# Altium schematic sheet zasilanie.SchDoc: Power supply
size A4
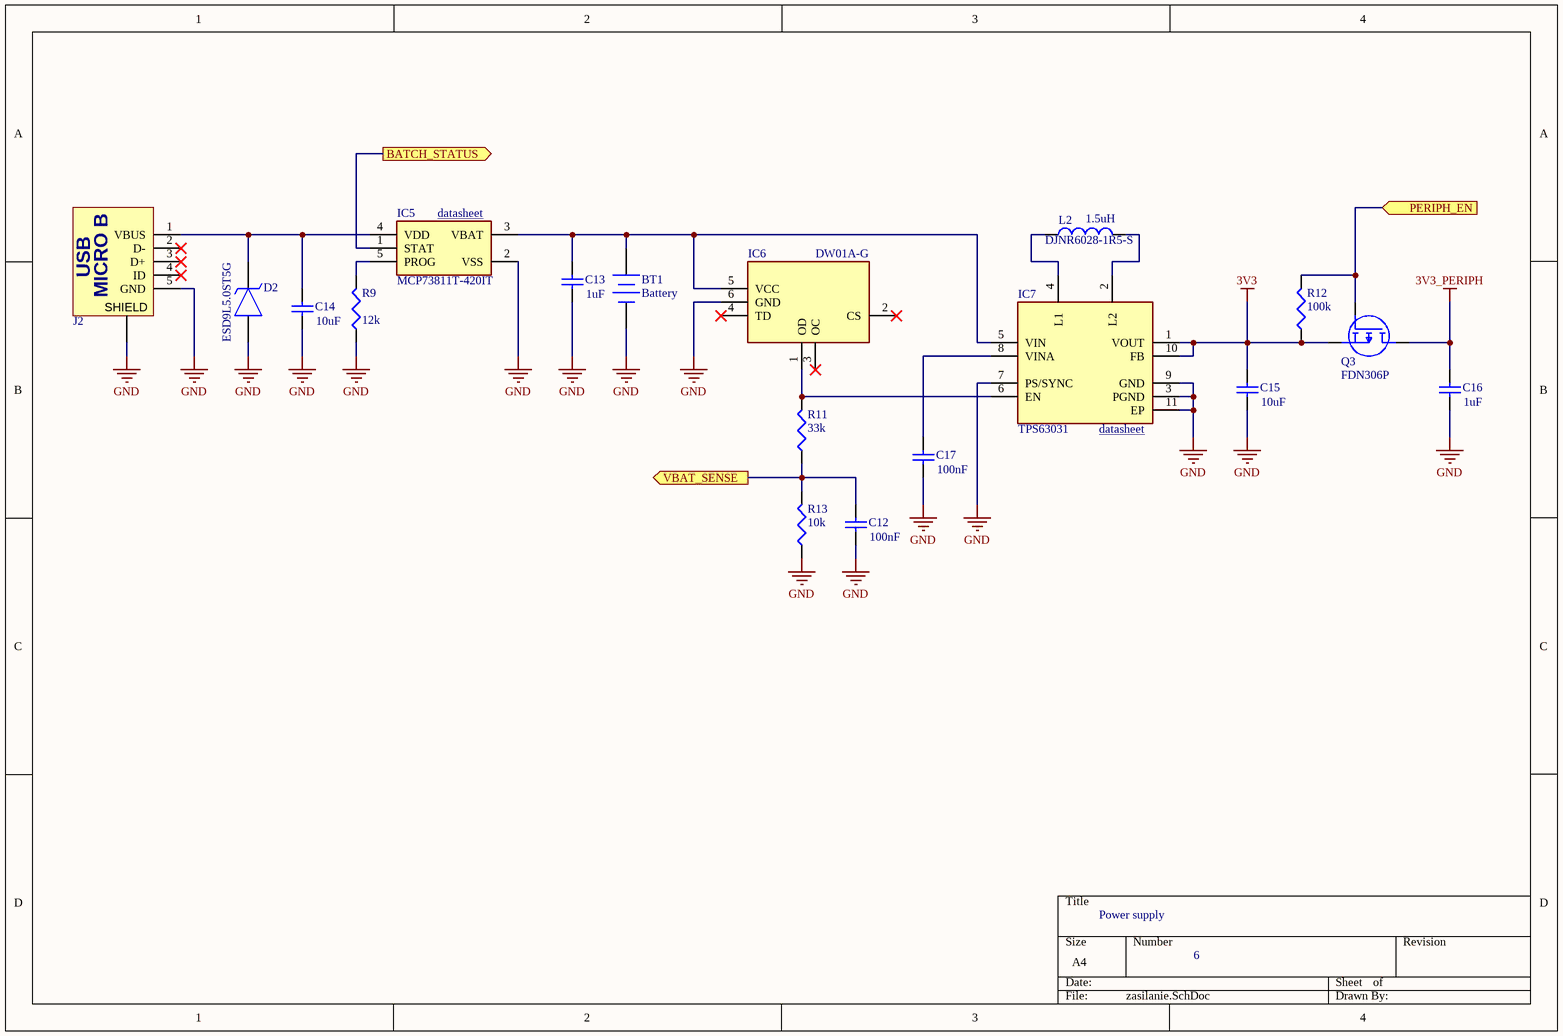
[diagram p0: zasilanie.SchDoc]

## Parts
BT1  Battery  [BAT_PAD]
C12  value 100nF  [C0805]  (hidden comment: Cap)
C13  value 1uF  [cap-0603]  (hidden comment: Cap)
C14  value 10uF  [cap-0603]  (hidden comment: Cap)
C15  value 10uF  [cap-0603]  (hidden comment: Cap)
C16  value 1uF  [cap-0603]  (hidden comment: Cap)
C17  value 100nF  [C0805]  (hidden comment: Cap)
D2  ESD9L5.0ST5G  [SODFL1006X40N]
IC5  MCP73811T-420IT  [SOT95P270X145-5N]
IC6  DW01A-G  [SOT95P280X135-6N]
IC7  TPS63031  [SON50P250X250X80-11N-D]
J2  Micro USB  [101181930001LF]  (value not drawn)
L2  DJNR6028-1R5-S  value 1.5uH  [DJNR6028-1R5-S]
Q3  FDN306P  [SOT95P237X112-3N]
R9  value 12k  [R0603]  (hidden comment: Res3)
R11  value 33k  [R0603]  (hidden comment: Res3)
R12  value 100k  [R0603]  (hidden comment: Res3)
R13  value 10k  [R0603]  (hidden comment: Res3)

## Ports
BATCH_STATUS (out), PERIPH_EN (in), VBAT_SENSE (out)

## Nets
3V3: C15.2 IC7.1(VOUT) IC7.10(FB) Q3.2(S) R12.2
3V3_PERIPH: C16.2 Q3.3(D)
GND: BT1.2(-) C12.1 C13.1 C14.1 C15.1 C16.1 C17.1 D2.2(A) IC5.2(VSS) IC6.6(GND) IC7.3(PGND) IC7.7(PS/SYNC) IC7.9(GND) IC7.11(EP) J2.5(GND) J2.6(SHIELD) R9.1 R13.2
BATCH_STATUS: IC5.1(STAT) ; port BATCH_STATUS
PERIPH_EN: Q3.1(G) R12.1 ; port PERIPH_EN
VBAT_SENSE: C12.2 R11.2 R13.1 ; port VBAT_SENSE
NetBT1_1: BT1.1(+) C13.2 IC5.3(VBAT) IC6.5(VCC) IC7.5(VIN)
NetC14_2: C14.2 D2.1(K) IC5.4(VDD) J2.1(VBUS)
NetC17_2: C17.2 IC7.8(VINA)
NetIC5_5: IC5.5(PROG) R9.2
NetIC6_1: IC6.1(OD) IC7.6(EN) R11.1
NetIC7_2: IC7.2(L2) L2.2
NetIC7_4: IC7.4(L1) L2.1

Not connected (* = marked no-connect by the designer): IC6 2(CS)* 3(OC)* 4(TD)*; J2 2(D-)* 3(D+)* 4(ID)*

## Notes on the sheet
- (near IC5) datasheet <http://ww1.microchip.com/downloads/en/DeviceDoc/MCP73831-Family-Data-Sheet-DS20001984H.pdf>
- (near IC7) datasheet <https://www.ti.com/lit/ds/slvs696d/slvs696d.pdf?ts=1594227141854&ref_url=https%253A%252F%252Fwww.google.com%252F>
- 6
- (in symbol USB-10118193-0001LF) USB; MICRO B

## Library data of the parts
BT1 = Battery: Multicell Battery; Published: 24-Mar-1999; LatestRevisionDate: 17-Jul-2002; LatestRevisionNote: Re-released for DXP Platform.; PackageReference: BAT-2; Publisher: Altium Limited; PackageDescription: Battery; 2 Leads
C12-C17 = Cap: Capacitor; Published: 8-Jun-2000; LatestRevisionDate: 17-Jul-2002; LatestRevisionNote: Re-released for DXP Platform.; PackageReference: RAD-0.3; Publisher: Altium Limited; PackageDescription: Radial Cap, Thru-Hole; 2 Leads; 0.3 in Pin Spacing
D2 = ESD9L5.0ST5G: Transil; Manufacturer_Name: ON Semiconductor; Datasheet Link: http://www.onsemi.com/pub/Collateral/ESD9L-D.PDF; Height: 0.4mm; Manufacturer_Part_Number: ESD9L5.0ST5G; Arrow Part Number: ESD9L5.0ST5G; Arrow Price/Stock: https://www.arrow.com/en/products/esd9l5.0st5g/on-semiconductor; Mouser Part Number: 863-ESD9L5.0ST5G; Mouser Price/Stock: https://www.mouser.co.uk/ProductDetail/ON-Semiconductor/ESD9L50ST5G?qs=lq5%252BOP7PS0%252BtbEEODUxZiA%3D%3D
IC5 = MCP73831T: Integrated Circuit; Manufacturer_Name: Microchip; Manufacturer_Part_Number: MCP73831T-5ACI/OT; Datasheet Link: http://www.microchip.com/mymicrochip/filehandler.aspx?ddocname=en025112; Height: 1.45mm; Arrow Part Number: MCP73831T-5ACI/OT; Arrow Price/Stock: https://www.arrow.com/en/products/mcp73831t-5aciot/microchip-technology; Mouser Part Number: 579-MCP73831T5ACIOT; Mouser Price/Stock: https://www.mouser.co.uk/ProductDetail/Microchip-Technology/MCP73831T-5ACI-OT?qs=hH%252BOa0VZEiAcgAcEkuamXg%3D%3D
IC6 = DW01A-G: Integrated Circuit; Manufacturer_Name: Fortune Semiconductor Corporation; Datasheet Link: http://acoptex.com/uploads/DW01A.pdf; Height: 1.35mm; Manufacturer_Part_Number: DW01A-G; Arrow Part Number: DW01A-G
IC7 = TPS63031DSKT: TPS63031 buck-boost 3v3; Manufacturer_Name: Texas Instruments; Datasheet Link: http://www.ti.com/lit/gpn/tps63031; Height: 0.8mm; Manufacturer_Part_Number: TPS63031DSKT; Arrow Part Number: TPS63031DSKT; Arrow Price/Stock: https://www.arrow.com/en/products/tps63031dskt/texas-instruments; Mouser Part Number: 595-TPS63031DSKT; Mouser Price/Stock: https://www.mouser.co.uk/ProductDetail/Texas-Instruments/TPS63031DSKT?qs=ptj1V1atRArBpxn4nGxMNw%3D%3D
J2 = USB-10118193-0001LF: model 10118193-0001LF amphenol; Datasheet Link: https://componentsearchengine.com/Datasheets/1/10118193-0001LF.pdf; Height: 3.1mm; Manufacturer_Name: Amphenol; Manufacturer_Part_Number: 10118193-0001LF; Arrow Part Number: 10118193-0001LF; Arrow Price/Stock: https://www.arrow.com/en/products/10118193-0001lf/amphenol-fci; Mouser Part Number: 649-10118193-0001LF; Mouser Price/Stock: https://www.mouser.co.uk/ProductDetail/Amphenol-FCI/10118193-0001LF?qs=Ywefl8B65e63Nsqd%252B8HZaQ%3D%3D
L2 = Inductor: Code_IEC: 1005; Published: 8-Jun-2000; LatestRevisionDate: 29-May-2009; LatestRevisionNote: IPC-7351 Footprint Added.; PackageReference: 0402-A; Publisher: Altium Limited; PackageDescription: Chip Inductor; Code_JEITA: 0402
Q3 = FDN306P: MOSFET (P-Channel); Manufacturer_Name: ON Semiconductor; Datasheet Link: http://uk.rs-online.com/web/p/products/1241702; Height: 1.12mm; Manufacturer_Part_Number: FDN306P; Arrow Part Number: FDN306P; Arrow Price/Stock: https://www.arrow.com/en/products/fdn306p/on-semiconductor; Mouser Part Number: 512-FDN306P; Mouser Price/Stock: https://www.mouser.co.uk/ProductDetail/ON-Semiconductor-Fairchild/FDN306P?qs=GeD7q9OHBPy9Kkc110idSQ%3D%3D
R9 R11-R13 = Res3: Resistor; Published: 8-Jun-2000; LatestRevisionDate: 29-May-2009; LatestRevisionNote: IPC-7351 Footprint Added.; PackageReference: J1-0603; Publisher: Altium Limited; PackageDescription: Chip Resistor